# EAGLE design cococartridge (EAGLE 7.5.0)
DESIGNER: Adam Green (https://github.com/adamgreen)
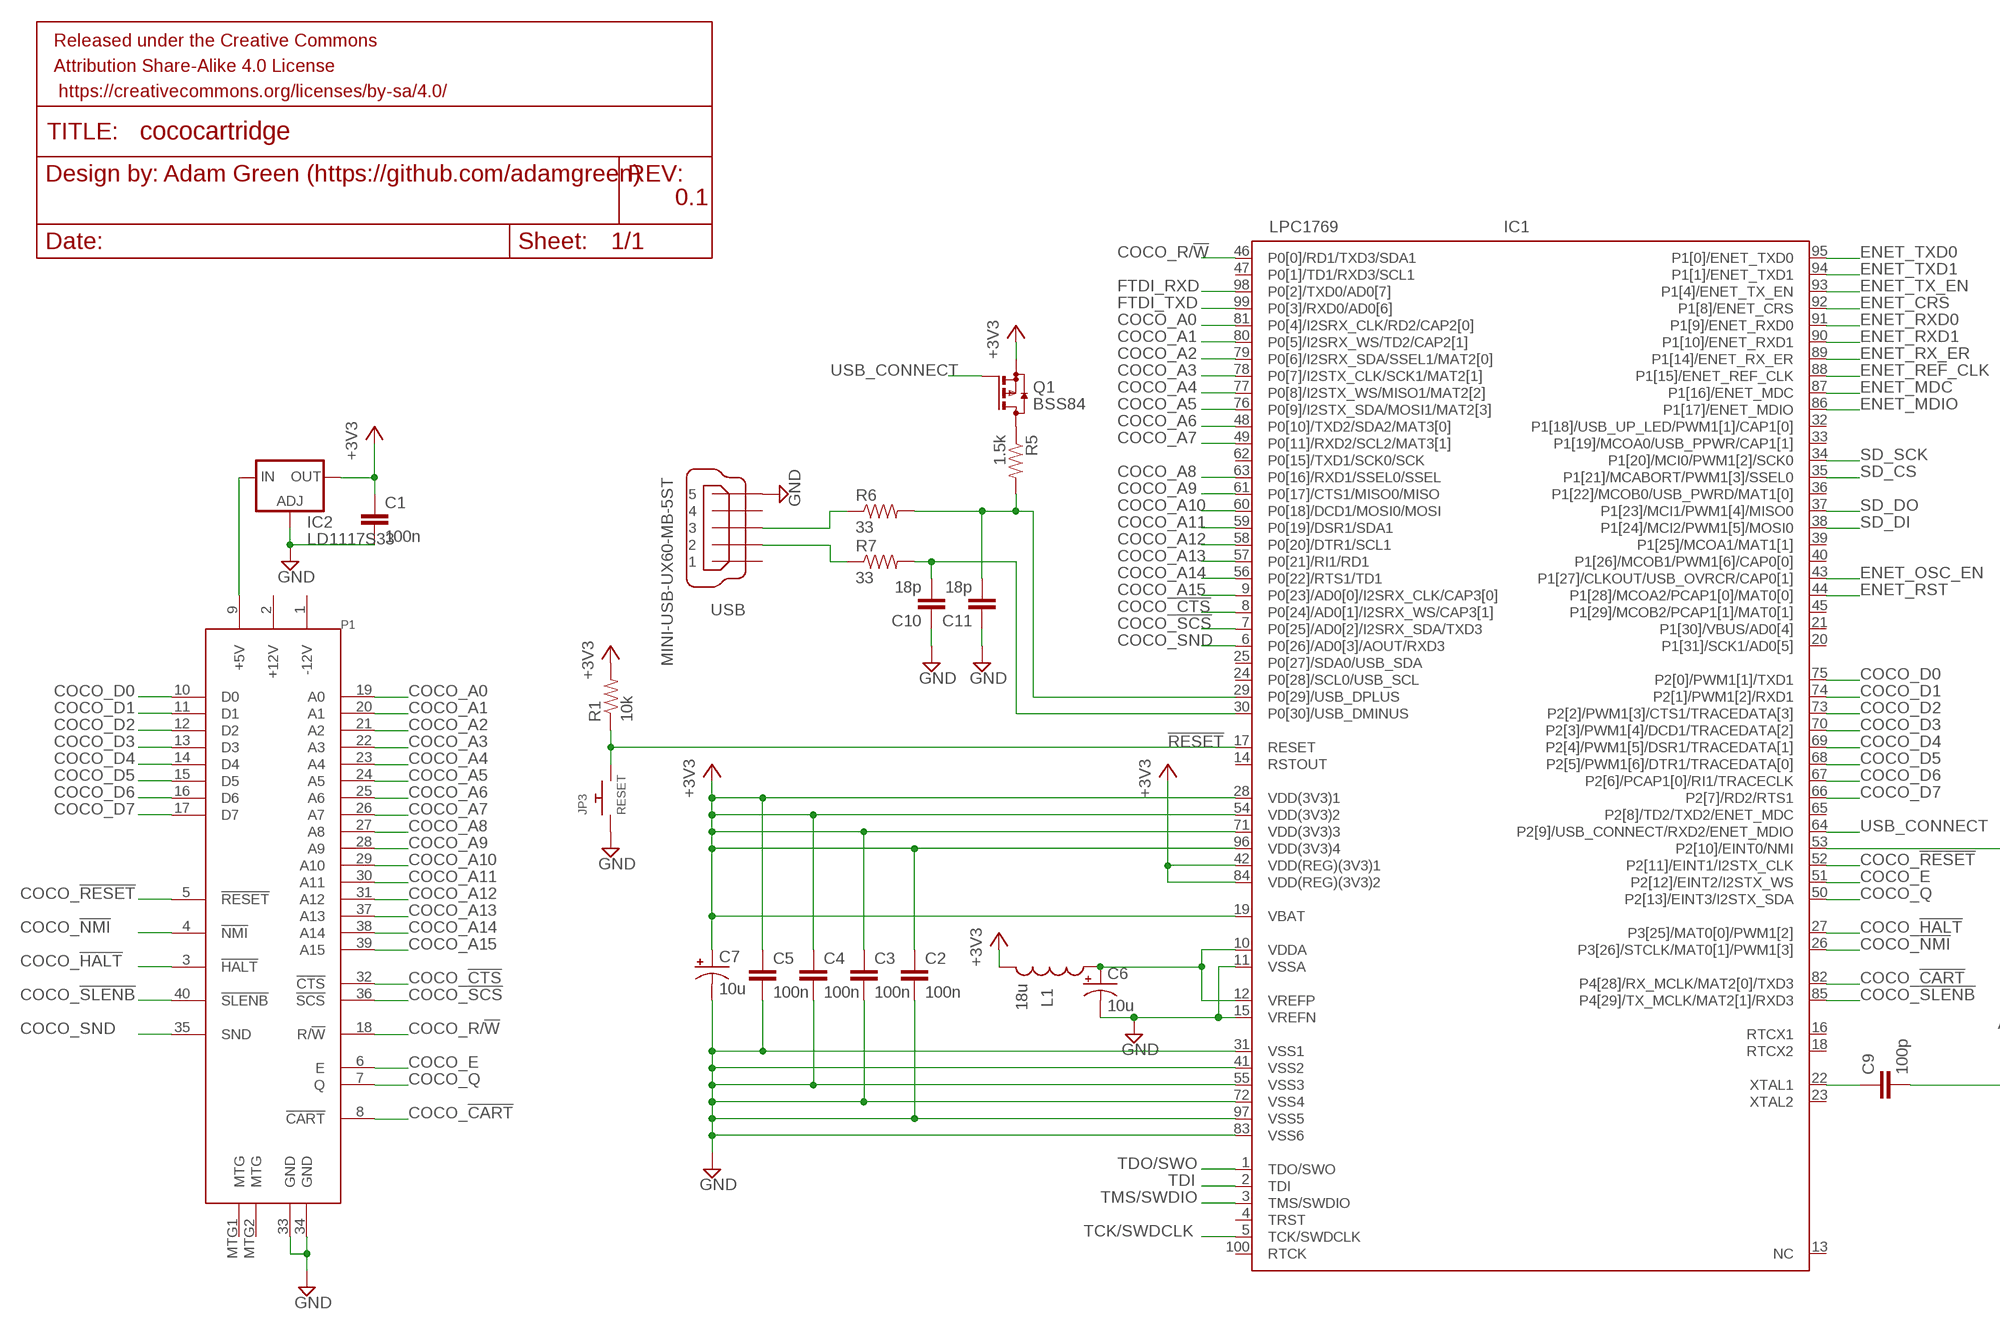
[diagram p0: schematic, sheet 1, part 1 of 2]
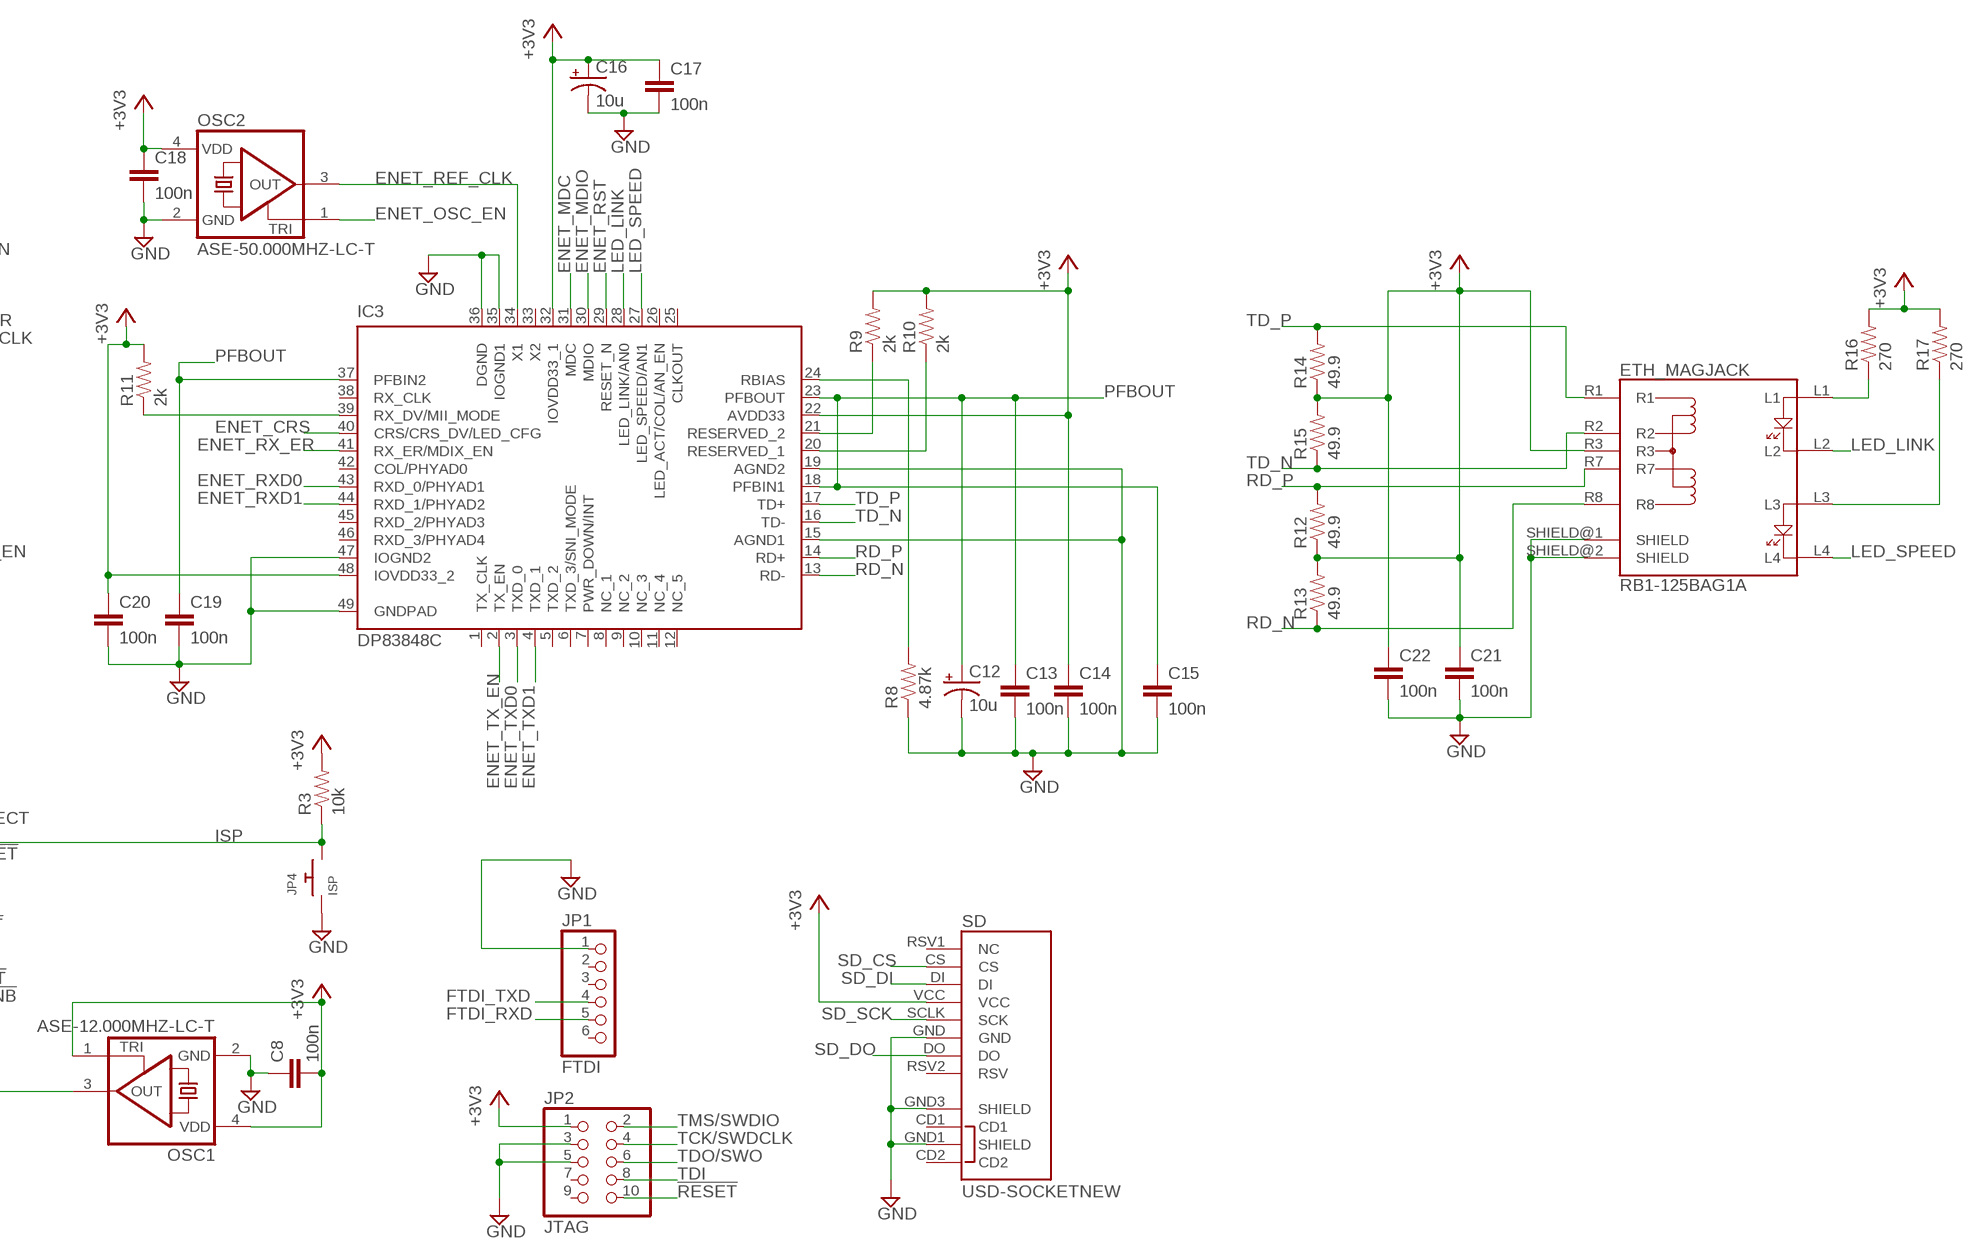
[diagram p1: schematic, sheet 1, part 2 of 2]

## Parts
C1  100n  CAP0805  [0805]
C2  100n  CAP0805  [0805]
C3  100n  CAP0805  [0805]
C4  100n  CAP0805  [0805]
C5  100n  CAP0805  [0805]
C6  10u  CAP_POL1206  [EIA3216]
C7  10u  CAP_POL1206  [EIA3216]
C8  100n  CAP0805  [0805]
C9  100p  CAP0805  [0805]
C10  18p  CAP0805  [0805]
C11  18p  CAP0805  [0805]
C12  10u  CAP_POL1206  [EIA3216]
C13  100n  CAP0805  [0805]
C14  100n  CAP0805  [0805]
C15  100n  CAP0805  [0805]
C16  10u  CAP_POL1206  [EIA3216]
C17  100n  CAP0805  [0805]
C18  100n  CAP0805  [0805]
C19  100n  CAP0805  [0805]
C20  100n  CAP0805  [0805]
C21  100n  CAP0805  [0805]
C22  100n  CAP0805  [0805]
ETH_MAGJACK  RB1-125BAG1A  [RB1-125BAG1A]
IC1  LPC1769  [LQFP100-14X14]
IC2  LD1117S33  LD117AS33TR  [SOT223]
IC3  DP83848C  [LQFP48]
JP1  FTDI  PINHD-1X6  [1X06]
JP2  JTAG  FTSH-105  [FTSH-105]
JP3  RESET  JUMPER-1206  [1206]
JP4  ISP  JUMPER-1206  [1206]
L1  18u  INDUCTOR1210  [1210]
OSC1  ASE-12.000MHZ-LC-T  ASE  [ASE]
OSC2  ASE-50.000MHZ-LC-T  ASE  [ASE]
P1  COCO-CART3.5X2.5  [COCO-CART-3.5X2.5]
Q1  BSS84  [SOT23]
R1  10k  RESISTOR0805-RES  [0805]
R3  10k  RESISTOR0805-RES  [0805]
R5  1.5k  RESISTOR0805-RES  [0805]
R6  33  RESISTOR0805-RES  [0805]
R7  33  RESISTOR0805-RES  [0805]
R8  4.87k  RESISTOR0805-RES  [0805]
R9  2k  RESISTOR0805-RES  [0805]
R10  2k  RESISTOR0805-RES  [0805]
R11  2k  RESISTOR0805-RES  [0805]
R12  49.9  RESISTOR0805-RES  [0805]
R13  49.9  RESISTOR0805-RES  [0805]
R14  49.9  RESISTOR0805-RES  [0805]
R15  49.9  RESISTOR0805-RES  [0805]
R16  270  RESISTOR0805-RES  [0805]
R17  270  RESISTOR0805-RES  [0805]
SD  USD-SOCKETNEW  [MICRO-SD-SOCKET-PP]
USB  MINI-USB-UX60-MB-5ST  [UX60-MB-5ST]

## Nets
!RESET: IC1.17(RESET) JP2.10 JP3.2 R1.1
+3V3 [supply]: C1.1 C2.1 C3.1 C4.1 C5.1 C7.A(+) C8.2 C14.1 C16.A(+) C17.1 C18.1 C20.1 C21.1 C22.1 ETH_MAGJACK.R3 IC1.19(VBAT) IC1.28(VDD(3V3)1) IC1.42(VDD(REG)(3V3)1) IC1.54(VDD(3V3)2) IC1.71(VDD(3V3)3) IC1.84(VDD(REG)(3V3)2) IC1.96(VDD(3V3)4) IC2.4(OUT) IC3.22(AVDD33) IC3.32(IOVDD33_1) IC3.48(IOVDD33_2) JP2.1 L1.2 OSC1.1(TRI) OSC1.4(VDD) OSC2.4(VDD) Q1.2(S) R1.2 R3.2 R9.2 R10.2 R11.2 R12.1 R13.2 R14.1 R15.2 R16.2 R17.2 SD.VCC
+5V [supply]: IC2.3(IN) P1.9(+5V)
COCO_!CART: IC1.82(P4[28]/RX_MCLK/MAT2[0]/TXD3) P1.8(!CART)
COCO_!CTS: IC1.8(P0[24]/AD0[1]/I2SRX_WS/CAP3[1]) P1.32(!CTS)
COCO_!HALT: IC1.27(P3[25]/MAT0[0]/PWM1[2]) P1.3(!HALT)
COCO_!NMI: IC1.26(P3[26]/STCLK/MAT0[1]/PWM1[3]) P1.4(!NMI)
COCO_!RESET: IC1.52(P2[11]/EINT1/I2STX_CLK) P1.5(!RESET)
COCO_!SCS: IC1.7(P0[25]/AD0[2]/I2SRX_SDA/TXD3) P1.36(!SCS)
COCO_!SLENB: IC1.85(P4[29]/TX_MCLK/MAT2[1]/RXD3) P1.40(!SLENB)
COCO_A0: IC1.81(P0[4]/I2SRX_CLK/RD2/CAP2[0]) P1.19(A0)
COCO_A1: IC1.80(P0[5]/I2SRX_WS/TD2/CAP2[1]) P1.20(A1)
COCO_A2: IC1.79(P0[6]/I2SRX_SDA/SSEL1/MAT2[0]) P1.21(A2)
COCO_A3: IC1.78(P0[7]/I2STX_CLK/SCK1/MAT2[1]) P1.22(A3)
COCO_A4: IC1.77(P0[8]/I2STX_WS/MISO1/MAT2[2]) P1.23(A4)
COCO_A5: IC1.76(P0[9]/I2STX_SDA/MOSI1/MAT2[3]) P1.24(A5)
COCO_A6: IC1.48(P0[10]/TXD2/SDA2/MAT3[0]) P1.25(A6)
COCO_A7: IC1.49(P0[11]/RXD2/SCL2/MAT3[1]) P1.26(A7)
COCO_A8: IC1.63(P0[16]/RXD1/SSEL0/SSEL) P1.27(A8)
COCO_A9: IC1.61(P0[17]/CTS1/MISO0/MISO) P1.28(A9)
COCO_A10: IC1.60(P0[18]/DCD1/MOSI0/MOSI) P1.29(A10)
COCO_A11: IC1.59(P0[19]/DSR1/SDA1) P1.30(A11)
COCO_A12: IC1.58(P0[20]/DTR1/SCL1) P1.31(A12)
COCO_A13: IC1.57(P0[21]/RI1/RD1) P1.37(A13)
COCO_A14: IC1.56(P0[22]/RTS1/TD1) P1.38(A14)
COCO_A15: IC1.9(P0[23]/AD0[0]/I2SRX_CLK/CAP3[0]) P1.39(A15)
COCO_D0: IC1.75(P2[0]/PWM1[1]/TXD1) P1.10(D0)
COCO_D1: IC1.74(P2[1]/PWM1[2]/RXD1) P1.11(D1)
COCO_D2: IC1.73(P2[2]/PWM1[3]/CTS1/TRACEDATA[3]) P1.12(D2)
COCO_D3: IC1.70(P2[3]/PWM1[4]/DCD1/TRACEDATA[2]) P1.13(D3)
COCO_D4: IC1.69(P2[4]/PWM1[5]/DSR1/TRACEDATA[1]) P1.14(D4)
COCO_D5: IC1.68(P2[5]/PWM1[6]/DTR1/TRACEDATA[0]) P1.15(D5)
COCO_D6: IC1.67(P2[6]/PCAP1[0]/RI1/TRACECLK) P1.16(D6)
COCO_D7: IC1.66(P2[7]/RD2/RTS1) P1.17(D7)
COCO_E: IC1.51(P2[12]/EINT2/I2STX_WS) P1.6(E)
COCO_Q: IC1.50(P2[13]/EINT3/I2STX_SDA) P1.7(Q)
COCO_R/!W: IC1.46(P0[0]/RD1/TXD3/SDA1) P1.18(R/!W)
COCO_SND: IC1.6(P0[26]/AD0[3]/AOUT/RXD3) P1.35(SND)
ENET_CRS: IC1.92(P1[8]/ENET_CRS) IC3.40(CRS/CRS_DV/LED_CFG)
ENET_MDC: IC1.87(P1[16]/ENET_MDC) IC3.31(MDC)
ENET_MDIO: IC1.86(P1[17]/ENET_MDIO) IC3.30(MDIO)
ENET_OSC_EN: IC1.43(P1[27]/CLKOUT/USB_OVRCR/CAP0[1]) OSC2.1(TRI)
ENET_REF_CLK: IC1.88(P1[15]/ENET_REF_CLK) IC3.34(X1) OSC2.3(OUT)
ENET_RST: IC1.44(P1[28]/MCOA2/PCAP1[0]/MAT0[0]) IC3.29(RESET_N)
ENET_RX_ER: IC1.89(P1[14]/ENET_RX_ER) IC3.41(RX_ER/MDIX_EN)
ENET_RXD0: IC1.91(P1[9]/ENET_RXD0) IC3.43(RXD_0/PHYAD1)
ENET_RXD1: IC1.90(P1[10]/ENET_RXD1) IC3.44(RXD_1/PHYAD2)
ENET_TX_EN: IC1.93(P1[4]/ENET_TX_EN) IC3.2(TX_EN)
ENET_TXD0: IC1.95(P1[0]/ENET_TXD0) IC3.3(TXD_0)
ENET_TXD1: IC1.94(P1[1]/ENET_TXD1) IC3.4(TXD_1)
FTDI_RXD: IC1.98(P0[2]/TXD0/AD0[7]) JP1.5
FTDI_TXD: IC1.99(P0[3]/RXD0/AD0[6]) JP1.4
GND [supply]: C1.2 C2.2 C3.2 C4.2 C5.2 C6.C(-) C7.C(-) C8.1 C10.1 C11.1 C12.C(-) C13.2 C14.2 C15.2 C16.C(-) C17.2 C18.2 C19.2 C20.2 C21.2 C22.2 ETH_MAGJACK.SHIELD@1(SHIELD) ETH_MAGJACK.SHIELD@2(SHIELD) IC1.11(VSSA) IC1.15(VREFN) IC1.31(VSS1) IC1.41(VSS2) IC1.55(VSS3) IC1.72(VSS4) IC1.83(VSS6) IC1.97(VSS5) IC2.1(ADJ) IC3.15(AGND1) IC3.19(AGND2) IC3.35(IOGND1) IC3.36(DGND) IC3.47(IOGND2) IC3.49(GNDPAD) JP1.1 JP2.3 JP2.5 JP3.1 JP4.1 OSC1.2(GND) OSC2.2(GND) P1.33(GND) P1.34(GND) R8.1 SD.GND SD.GND1(SHIELD) SD.GND3(SHIELD) USB.5
ISP: IC1.53(P2[10]/EINT0/NMI) JP4.2 R3.1
LED_LINK: ETH_MAGJACK.L2 IC3.28(LED_LINK/AN0)
LED_SPEED: ETH_MAGJACK.L4 IC3.27(LED_SPEED/AN1)
N$3: C6.A(+) IC1.10(VDDA) IC1.12(VREFP) L1.1
N$4: C9.1 IC1.22(XTAL1)
N$5: C9.2 OSC1.3(OUT)
N$6: IC3.24(RBIAS) R8.2
N$8: Q1.3(D) R5.1
N$11: IC3.39(RX_DV/MII_MODE) R11.1
N$12: IC3.21(RESERVED_2) R9.1
N$13: IC3.20(RESERVED_1) R10.1
N$14: ETH_MAGJACK.L1 R16.1
N$15: ETH_MAGJACK.L3 R17.1
PFBOUT: C12.A(+) C13.1 C15.1 C19.1 IC3.18(PFBIN1) IC3.23(PFBOUT) IC3.37(PFBIN2)
RD_N [ethernet]: ETH_MAGJACK.R8 IC3.13(RD-) R13.1
RD_P [ethernet]: ETH_MAGJACK.R7 IC3.14(RD+) R12.2
SD_CS: IC1.35(P1[21]/MCABORT/PWM1[3]/SSEL0) SD.CS
SD_DI: IC1.38(P1[24]/MCI2/PWM1[5]/MOSI0) SD.DI
SD_DO: IC1.37(P1[23]/MCI1/PWM1[4]/MISO0) SD.DO
SD_SCK: IC1.34(P1[20]/MCI0/PWM1[2]/SCK0) SD.SCLK(SCK)
TCK/SWDCLK: IC1.5(TCK/SWDCLK) JP2.4
TD_N [ethernet]: ETH_MAGJACK.R2 IC3.16(TD-) R15.1
TD_P [ethernet]: ETH_MAGJACK.R1 IC3.17(TD+) R14.2
TDI: IC1.2(TDI) JP2.8
TDO/SWO: IC1.1(TDO/SWO) JP2.6
TMS/SWDIO: IC1.3(TMS/SWDIO) JP2.2
USB2_N [usb]: R7.1 USB.2
USB2_P [usb]: R6.1 USB.3
USB_CONNECT: IC1.64(P2[9]/USB_CONNECT/RXD2/ENET_MDIO) Q1.1(G)
USB_N [usb]: C10.2 IC1.30(P0[30]/USB_DMINUS) R7.2
USB_P [usb]: C11.2 IC1.29(P0[29]/USB_DPLUS) R5.2 R6.2
Unconnected: IC1.4(TRST) IC1.13(NC) IC1.14(RSTOUT) IC1.16(RTCX1) IC1.18(RTCX2) IC1.20(P1[31]/SCK1/AD0[5]) IC1.21(P1[30]/VBUS/AD0[4]) IC1.23(XTAL2) IC1.24(P0[28]/SCL0/USB_SCL) IC1.25(P0[27]/SDA0/USB_SDA) IC1.32(P1[18]/USB_UP_LED/PWM1[1]/CAP1[0]) IC1.33(P1[19]/MCOA0/USB_PPWR/CAP1[1]) IC1.36(P1[22]/MCOB0/USB_PWRD/MAT1[0]) IC1.39(P1[25]/MCOA1/MAT1[1]) IC1.40(P1[26]/MCOB1/PWM1[6]/CAP0[0]) IC1.45(P1[29]/MCOB2/PCAP1[1]/MAT0[1]) IC1.47(P0[1]/TD1/RXD3/SCL1) IC1.62(P0[15]/TXD1/SCK0/SCK) IC1.65(P2[8]/TD2/TXD2/ENET_MDC) IC1.100(RTCK) IC3.1(TX_CLK) IC3.5(TXD_2) IC3.6(TXD_3/SNI_MODE) IC3.7(PWR_DOWN/INT) IC3.8(NC_1) IC3.9(NC_2) IC3.10(NC_3) IC3.11(NC_4) IC3.12(NC_5) IC3.25(CLKOUT) IC3.26(LED_ACT/COL/AN_EN) IC3.33(X2) IC3.38(RX_CLK) IC3.42(COL/PHYAD0) IC3.45(RXD_2/PHYAD3) IC3.46(RXD_3/PHYAD4) JP1.2 JP1.3 JP1.6 JP2.7 JP2.9 P1.1(-12V) P1.2(+12V) P1.MTG1(MTG) P1.MTG2(MTG) SD.CD1 SD.CD2 SD.RSV1(NC) SD.RSV2(RSV) USB.1 USB.4

## Notes on the sheet
- 0.1

## Library data of the parts
C1-C5 C8-C11 C13-C15 C17-C22 = SparkFun-Passives:CAP: Capacitor Standard 0603 ceramic capacitor, and 0.1" leaded capacitor.
C6 C7 C12 C16 = SparkFun-Capacitors:CAP_POL: Capacitor Polarized These are standard SMD and PTH capacitors. Normally 10uF, 47uF, and 100uF in electrolytic and tantalum varieties. Always verify the external diameter of the through hole cap, it varies with capacity, voltage, and manufacturer. The EIA devices should be standard.
ETH_MAGJACK = adam_custom:RB1-125BAG1A: MagJack RB1-125BAG1A Based on libraries found in this Eagle project: https://github.com/4jochen/WIZ820io-Piggyback-RaspberryPi
IC1 = lpc1xxx-v6:LPC1769: LPC1769 120 MHz 32-bit ARM Cortex-M3 based microcontroller featuring a high level of integration and low power consumption. 512 kB Flash, 64 kB SRAM, USB Device/Host/OTG, 2 CAN, DAC, Ethernet MarcVl - Datasheet available on www.nxp.com
IC2 = v-reg:LD117A?*: Low drop fixed and adjustable positive voltage regulators 1 A Source: http://www.st.com/stonline/products/literature/ds/7194/ld1117axx.pdf
IC3 = adam_custom:DP83848C: PHYTER® - Extended Temperature Single Port 10/100 Mb/s Ethernet Physical Layer Transceiver Based on device described in National Semiconductor library that ships with Eagle. Auto generated by make-symbol-device-package-bsdl.ulp Rev. 34 Source: dp83848yb.bsdl http://www.national.com/ds/DP/DP83848VYB.pdf
JP1 = pinhead:PINHD-1X6: PIN HEADER
JP2 = adam_custom:FTSH-105: Semtec FSH-105 2x5 SMT Micro Header Commonly used for 10-pin ARM Cortex-M JTAG/SWD Debug Header.
JP3 JP4 = adam_custom:JUMPER-1206: Jumper based on 1206 SMT pads Useful for switches that won't often be used. Can short out temporarily with tweezers or solder a switch to during development. Symbol is based on one from Adafruit Eagle library found here: https://github.com/adafruit/Adafruit-Eagle-Library
L1 = SparkFun-Passives:INDUCTOR: Inductors Basic Inductor/Choke - 0603 and 1206. Footprints are not proven and vary greatly between part numbers. INDUCTOR POWER 3.3UH 4.0A SMD 0.197" L x 0.197" W x 0.177" H (5.00mm x 5.00mm x 4.50mm)
OSC1 OSC2 = crystal:ASE: 3.3Vdc CMOS SMD CRYSTAL CLOCK OSCILLATOR SOurce: www.abracon.com; OC_FARNELL: unknown; OC_NEWARK: unknown
P1 = adam_custom:COCO-CART: Tandy/TRS-80 Color Computer Cartridge Connector Based on Mark J. Blair's CoCo cartridge Eagle project found here: https://github.com/NF6X/CoCoEPROMpak
Q1 = transistor-small-signal:BSS84: P-CHANNEL MOS FET
R1 R3 R5-R17 = SparkFun-Resistors:RESISTOR: Resistor Basic schematic elements and footprints for 0603, 1206, and PTH resistors.
SD = adam_custom:USD-SOCKET: microSD Socket Push-push type uSD socket. Schematic element and footprint production proven. Spark Fun Electronics SKU : PRT-00127. tDoc lines correctly indicate media card edge positions when inserting (unlocked, locked, depressed). NOTE: CD1 and CD2 are connected internally; PROD_ID: CONN-07820
USB = con-hirose:MINI-USB-: MINI USB Connector Source: http://www.hirose.co.jp/cataloge_hp/e24000019.pdf; OC_FARNELL: unknown; OC_NEWARK: unknown

## Net classes
0 default: width 0.152 mm, clearance 0.152 mm
1 supply: width 0.152 mm, clearance 0.152 mm
2 io: width 0.152 mm, clearance 0.152 mm
3 usb: width 0.254 mm, clearance 0.152 mm
4 ethernet: width 0.254 mm, clearance 0.152 mm

## Board
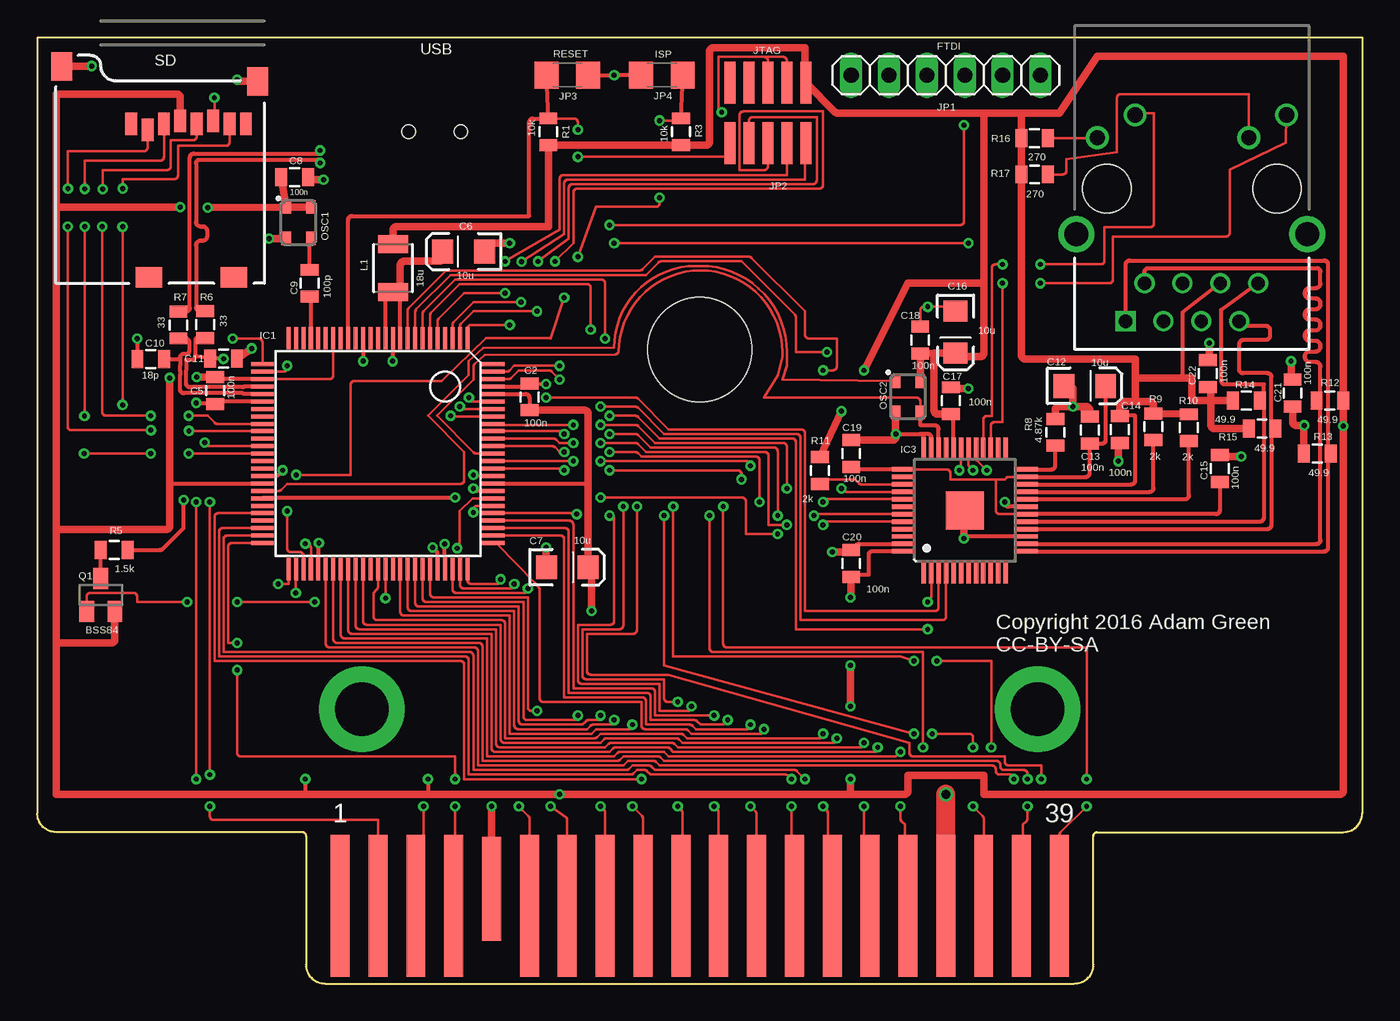
[diagram p2: board, top side]
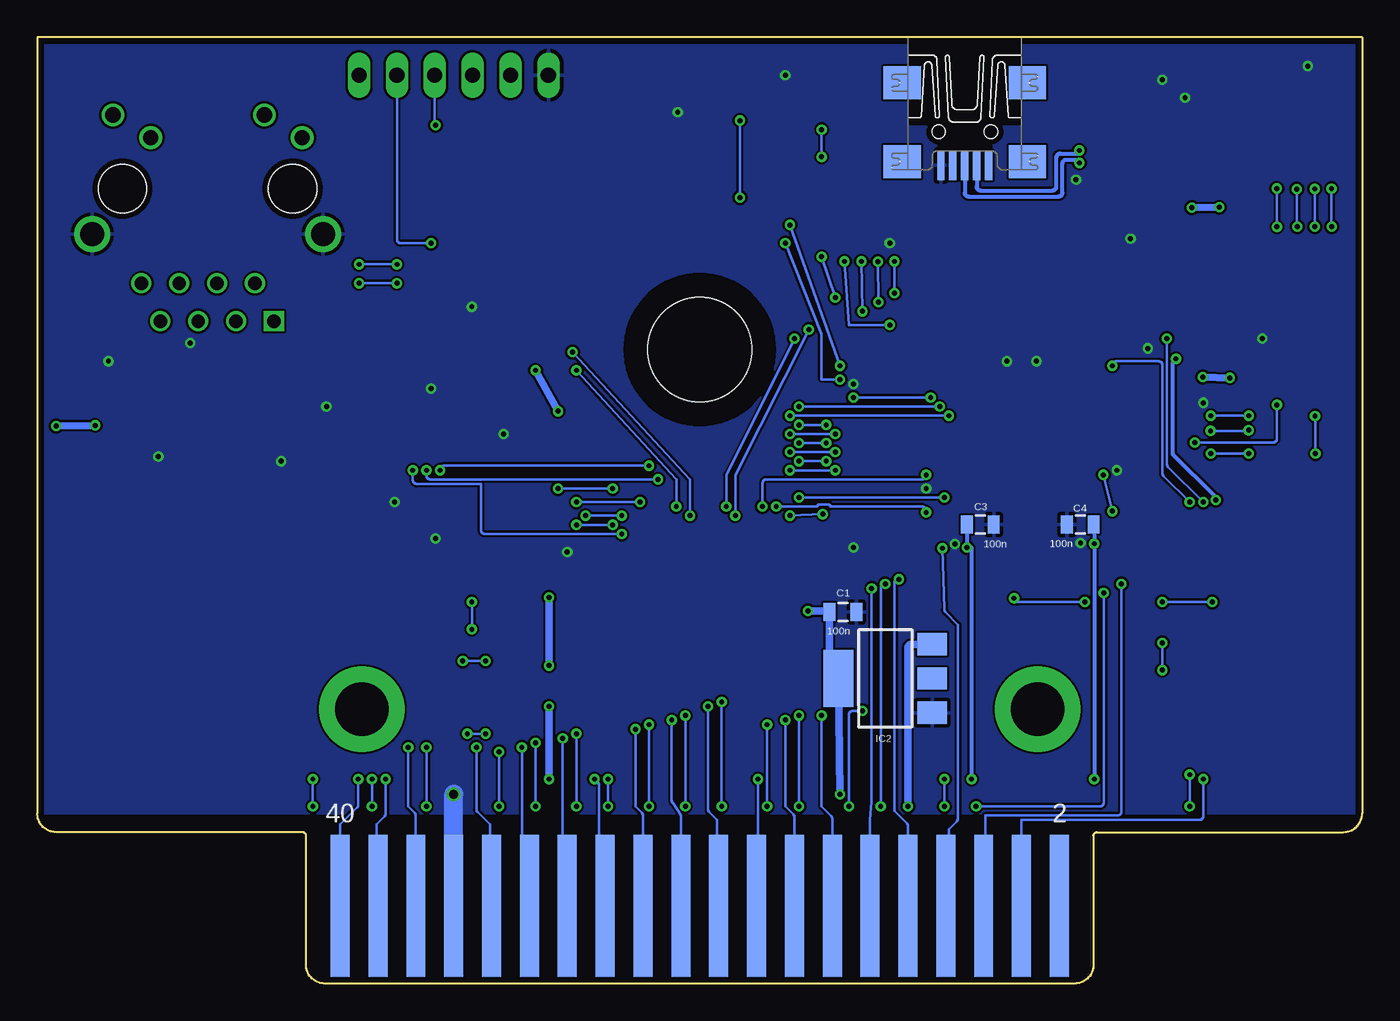
[diagram p3: board, bottom side, seen from below]

Size 88.9 x 63.5 mm. Coordinates in mm from the lower left corner, seen from the top.
Copper layers (1*16): Top 0.0356mm / dielectric 1.5011mm / Bottom 0.0356mm
Design rules "LaenPCBOrder": minimum track width 6mil, minimum drill 13mil, track to track 6mil, track to pad 6mil, pad to pad 6mil, via to via 6mil, smd to smd 6mil, copper to edge 15mil, drill to drill 6mil, minimum pad ring 7mil, minimum via ring 7mil, stop-mask expansion 3mil, vias tented up to drill 0mil, thermal gap 10mil

### Footprints (pad centres in the part's own frame; a part is rotated, then mirrored left to right if it is on the bottom)
0805 = smd 0.8 x 1.2: 1 -0.9,0; 2 0.9,0
EIA3216 = smd 1.4 x 1.6: A 1.4,0; C -1.4,0
RB1-125BAG1A = drill 1.02: L1 6.35,-3.429; L2 3.81,-4.953; L3 -3.81,-3.429; L4 -6.35,-4.953 | drill 0.9: R1 -4.445,6.35; R2 -3.175,8.89; R3 -1.905,6.35; R4 -0.635,8.89; R5 0.635,6.35; R6 1.905,8.89; R7 3.175,6.35 | drill 0.9 square: R8 4.445,8.89 | drill 1.6: SHIELD@1 -7.747,3.048; SHIELD@2 7.747,3.048 | hole 3.25: 5.715,0; -5.715,0
LQFP100-14X14 = smd 0.27 x 1.5: 1 -6,-7.75; 2 -5.5,-7.75; 3 -5,-7.75; 4 -4.5,-7.75; 5 -4,-7.75; 6 -3.5,-7.75; 7 -3,-7.75; 8 -2.5,-7.75; 9 -2,-7.75; 10 -1.5,-7.75; 11 -1,-7.75; 12 -0.5,-7.75; 13 0,-7.75; 14 0.5,-7.75; 15 1,-7.75; 16 1.5,-7.75; 17 2,-7.75; 18 2.5,-7.75; 19 3,-7.75; 20 3.5,-7.75; 21 4,-7.75; 22 4.5,-7.75; 23 5,-7.75; 24 5.5,-7.75; 25 6,-7.75; 51 6,7.75; 52 5.5,7.75; 53 5,7.75; 54 4.5,7.75; 55 4,7.75; 56 3.5,7.75; 57 3,7.75; 58 2.5,7.75; 59 2,7.75; 60 1.5,7.75; 61 1,7.75; 62 0.5,7.75; 63 0,7.75; 64 -0.5,7.75; 65 -1,7.75; 66 -1.5,7.75; 67 -2,7.75; 68 -2.5,7.75; 69 -3,7.75; 70 -3.5,7.75; 71 -4,7.75; 72 -4.5,7.75; 73 -5,7.75; 74 -5.5,7.75; 75 -6,7.75 | smd 1.5 x 0.27: 26 7.75,-6; 27 7.75,-5.5; 28 7.75,-5; 29 7.75,-4.5; 30 7.75,-4; 31 7.75,-3.5; 32 7.75,-3; 33 7.75,-2.5; 34 7.75,-2; 35 7.75,-1.5; 36 7.75,-1; 37 7.75,-0.5; 38 7.75,0; 39 7.75,0.5; 40 7.75,1; 41 7.75,1.5; 42 7.75,2; 43 7.75,2.5; 44 7.75,3; 45 7.75,3.5; 46 7.75,4; 47 7.75,4.5; 48 7.75,5; 49 7.75,5.5; 50 7.75,6; 76 -7.75,6; 77 -7.75,5.5; 78 -7.75,5; 79 -7.75,4.5; 80 -7.75,4; 81 -7.75,3.5; 82 -7.75,3; 83 -7.75,2.5; 84 -7.75,2; 85 -7.75,1.5; 86 -7.75,1; 87 -7.75,0.5; 88 -7.75,0; 89 -7.75,-0.5; 90 -7.75,-1; 91 -7.75,-1.5; 92 -7.75,-2; 93 -7.75,-2.5; 94 -7.75,-3; 95 -7.75,-3.5; 96 -7.75,-4; 97 -7.75,-4.5; 98 -7.75,-5; 99 -7.75,-5.5; 100 -7.75,-6
SOT223 = smd 1.5 x 2: 1 -2.3,-3.15; 2 0,-3.15; 3 2.3,-3.15 | smd 3.8 x 2: 4 0,3.15
LQFP48 = smd 1.5 x 0.3: 1 -4.15,2.75; 2 -4.15,2.25; 3 -4.15,1.75; 4 -4.15,1.25; 5 -4.15,0.75; 6 -4.15,0.25; 7 -4.15,-0.25; 8 -4.15,-0.75; 9 -4.15,-1.25; 10 -4.15,-1.75; 11 -4.15,-2.25; 12 -4.15,-2.75; 25 4.15,-2.75; 26 4.15,-2.25; 27 4.15,-1.75; 28 4.15,-1.25; 29 4.15,-0.75; 30 4.15,-0.25; 31 4.15,0.25; 32 4.15,0.75; 33 4.15,1.25; 34 4.15,1.75; 35 4.15,2.25; 36 4.15,2.75 | smd 0.3 x 1.5: 13 -2.75,-4.15; 14 -2.25,-4.15; 15 -1.75,-4.15; 16 -1.25,-4.15; 17 -0.75,-4.15; 18 -0.25,-4.15; 19 0.25,-4.15; 20 0.75,-4.15; 21 1.25,-4.15; 22 1.75,-4.15; 23 2.25,-4.15; 24 2.75,-4.15; 37 2.75,4.15; 38 2.25,4.15; 39 1.75,4.15; 40 1.25,4.15; 41 0.75,4.15; 42 0.25,4.15; 43 -0.25,4.15; 44 -0.75,4.15; 45 -1.25,4.15; 46 -1.75,4.15; 47 -2.25,4.15; 48 -2.75,4.15 | smd 2.54 x 2.54: 49 0,0
1X06 = drill 1.016 long: 1 -6.35,0; 2 -3.81,0; 3 -1.27,0; 4 1.27,0; 5 3.81,0; 6 6.35,0
FTSH-105 = smd 0.737 x 2.794: 1 -2.54,-2.032; 2 -2.54,2.032; 3 -1.27,-2.032; 4 -1.27,2.032; 5 0,-2.032; 6 0,2.032; 7 1.27,-2.032; 8 1.27,2.032; 9 2.54,-2.032; 10 2.54,2.032
1206 = smd 1.6 x 1.8: 1 -1.4,0; 2 1.4,0
1210 = smd 1.2 x 2: 1 -1.6,0; 2 1.6,0
ASE = smd 0.9 x 0.65: 1 -1.05,-0.825; 2 1.05,-0.825; 3 1.05,0.825; 4 -1.05,0.825
COCO-CART-3.5X2.5 = smd 1.27 x 9.525: 1 20.32,5.207; 3 22.86,5.207; 5 25.4,5.207; 7 27.94,5.207; 11 33.02,5.207; 13 35.56,5.207; 15 38.1,5.207; 17 40.64,5.207; 19 43.18,5.207; 21 45.72,5.207; 23 48.26,5.207; 25 50.8,5.207; 27 53.34,5.207; 29 55.88,5.207; 31 58.42,5.207; 33 60.96,5.207; 35 63.5,5.207; 37 66.04,5.207; 39 68.58,5.207 | smd 1.27 x 9.525 bottom: 2 20.32,5.207; 4 22.86,5.207; 6 25.4,5.207; 8 27.94,5.207; 10 30.48,5.207; 12 33.02,5.207; 14 35.56,5.207; 16 38.1,5.207; 18 40.64,5.207; 20 43.18,5.207; 22 45.72,5.207; 24 48.26,5.207; 26 50.8,5.207; 28 53.34,5.207; 30 55.88,5.207; 32 58.42,5.207; 34 60.96,5.207; 36 63.5,5.207; 38 66.04,5.207; 40 68.58,5.207 | smd 1.27 x 6.985: 9 30.48,6.35 | drill 3.607 pad 5.715: MTG1 21.78,18.415; MTG2 67.12,18.415 | hole 6.985: 44.45,42.545
SOT23 = smd 1 x 1.4: 1 -0.95,-1.1; 2 0.95,-1.1; 3 0,1.1
MICRO-SD-SOCKET-PP = smd 1.8 x 1.4: CD1 -2.05,0.4; CD2 -7.75,0.4 | smd 0.8 x 1.5: CS -7.84,10.3; DI -6.74,10.7; DO -2.34,10.7; GND -3.44,10.9; RSV1 -8.94,10.7; RSV2 -1.24,10.7; SCLK -4.54,10.7; VCC -5.64,10.9 | smd 1.4 x 1.9: GND1 -13.6,14.55; GND3 -0.45,13.55
UX60-MB-5ST = smd 2 x 0.5: 1 2.25,1.6; 2 2.25,0.8; 3 2.25,0; 4 2.25,-0.8; 5 2.25,-1.6 | smd 2.2 x 2.5: M1 -3.3,-4.2; M2 -3.3,4.2; M3 2,4.2; M4 2,-4.2 | hole 0.9: 0,-1.75; 0,1.75

### Placement (x,y rotation side)
C1  34.85,24.94 0 bottom
C2  33.02,39.37 90 top
C3  25.63,30.81 0 bottom
C4  18.92,30.81 180 bottom
C5  11.94,39.79 270 top
C6  28.6,49.12 180 top
C7  35.56,27.94 0 top
C8  17.27,54.1 180 top
C9  18.29,46.99 90 top
C10  7.62,41.91 0 top
C11  12.5,41.94 180 top
C12  70.28,40.1 0 top
C13  70.62,37.13 90 top
C14  72.64,37.18 270 top
C15  79.34,34.56 90 top
C16  61.61,43.71 270 top
C17  61.3,39.11 90 top
C18  59.24,43.18 90 top
C19  54.61,35.56 90 top
C20  54.61,28.19 90 top
C21  84.22,39.62 90 top
C22  78.55,40.93 90 top
ETH_MAGJACK  77.47,53.34 180 top
IC1  22.86,35.56 180 top
IC2  32,20.47 90 bottom
IC3  62.23,31.75 90 top
JP1  60.96,60.96 0 top
JP2  49.02,58.42 180 top
JP3  35.56,60.96 180 top
JP4  41.91,60.96 0 top
L1  23.88,48.01 90 top
OSC1  17.53,51.05 270 top
OSC2  58.42,39.37 270 top
P1  0,0 0 top
Q1  4.26,26.08 0 top
R1  34.29,57.15 270 top
R3  43.18,57.15 270 top
R5  5.17,29.1 0 top
R6  11.28,44.22 270 top
R7  9.47,44.2 270 top
R8  68.3,36.99 270 top
R9  74.89,37.36 90 top
R10  77.27,37.3 90 top
R11  52.51,34.43 90 top
R12  86.73,39.11 180 top
R13  85.89,35.57 180 top
R14  81.13,39.13 0 top
R15  82.18,37.25 180 top
R16  66.92,56.73 180 top
R17  66.92,54.3 180 top
SD  15.24,46.99 0 top
USB  26.67,57.15 270 bottom

### Tracks (layer width: path | path; a pad name or v marks a point on that pad's centre or on a via)
!RESET  (via drill 0.33)
  Top 0.152: v36.27,55.47 46.23,55.47 arc90 46.48,55.73 JP2.10 | v36.27,57.3 36.27,57.8 arc90 36.02,58.05 R1.1
  Top 0.254: JP3.2 R1.1 33.26,58.05 arc90 33.01,57.8 33.01,51.5 21.11,51.5 arc90 20.86,51.25 IC1.17
  Bottom 0.152: v36.27,57.3 v36.27,55.47
+3V3  (via drill 0.33)
  Top 0.152: IC1.28 19.61,40.56 arc90 19.86,40.81 IC1.19 | IC1.54 18.36,29.26 arc90 18.11,29.52 v17.98,29.52
  Top 0.254: 36.96,33.4 arc90 36.83,33.53 36.83,33.56 IC1.84 | IC1.96 32.77,39.56 arc-90 33.02,39.31 C2.1 | IC1.28 12.16,40.56 arc-90 C5.1 | IC3.32 61.48,38.03 arc90 C17.1 | IC3.22 73.41,33.5 arc90 73.66,33.75 73.66,38.1 72.66,38.1 arc90 C14.1 | 8.89,33.31 8.89,33.02 | ETH_MAGJACK.R3 76.83,45.03 76.83,40.89 arc-90 76.58,40.64 76.2,40.64 | IC1.71 26.86,28.81 arc45 26.79,28.99 v26.52,29.26 | IC3.48 56.03,29 arc90 55.78,28.75 55.78,27.43 54.75,27.43 arc90 C20.1 | IC1.42 arc-90 15.08,33.53 8.89,33.53 | v26.21,13.72 26.21,12.7 | v17.98,13.72 17.98,12.7
  Top 0.508: SD.VCC 9.6,59.44 arc90 9.35,59.69 1.27,59.69 1.27,52.07 | 1.27,52.07 1.27,30.48 | 1.27,30.48 1.27,22.86 | 1.27,22.86 1.27,12.7 17.98,12.7 26.21,12.7 v35.05,12.7 54.56,12.7 | 1.3,52.1 arc90 1.27,52.07 | C2.1 36.71,38.47 arc-90 36.96,38.22 36.96,33.4 C7.A arc90 36.83,27.81 36.93,27.81 arc-90 37.19,27.56 v37.19,24.99 | 87.63,38.1 v87.63,37.41 87.63,12.95 arc-90 87.38,12.7 63.5,12.7 63.5,13.97 58.42,13.97 58.42,12.95 arc-90 58.17,12.7 54.56,12.7 | 87.63,38.1 87.63,62.23 71.12,62.23 68.58,58.42 arc-90 68.57,58.41 66.04,58.41 | 62.23,42.06 arc90 61.98,42.31 C16.A 60.18,42.29 | 62.23,42.06 62.23,41.91 | 60.18,42.29 C18.1 OSC2.4 | C17.1 60.43,38.21 arc-90 60.18,38.47 60.18,42.29 | C8.2 OSC1.1 OSC1.4 v11.43,52.07 | L1.2 23.88,50.55 arc-90 24.13,50.8 34.29,50.8 R1.2 R3.2 44.86,56.25 arc90 45.11,56.5 45.11,62.53 arc-90 45.37,62.79 51.51,62.79 51.51,60.5 arc90 JP2.1 53.53,58.49 arc45 53.71,58.41 63.5,58.41 | 63.5,58.41 66.04,58.41 | R10.2 R9.2 74.89,38.8 arc90 74.64,39.05 73.66,39.05 | 73.66,39.05 72.9,39.05 arc90 72.64,38.8 C14.1 | 73.66,40.64 73.66,41.91 66.29,41.91 arc-90 66.04,42.16 66.04,54.61 | 73.66,40.64 73.66,39.05 | R14.1 78.74,39.13 | 78.74,39.13 77.72,39.13 arc-90 77.47,39.38 77.47,40.64 76.2,40.64 73.66,40.64 | R15.2 78.99,37.25 arc-90 78.74,37.5 78.74,39.13 | R13.2 84.99,37.43 arc-90 v85.01,37.46 84.48,37.46 arc-90 84.22,37.71 C21.1 | C22.1 arc-90 78.74,39.84 78.74,39.13 | 66.04,54.61 66.04,57.15 | 66.04,57.15 66.04,58.41 | 62.23,42.06 63.25,42.06 arc90 63.5,42.31 63.5,46.99 | 63.5,46.99 63.5,58.41 | 63.5,46.99 58.42,46.99 v55.47,41.15 | R16.2 66.04,57.15 | R17.2 66.04,54.61
  Top 0.508: v8.89,40.64 8.89,33.53 8.89,33.02 8.89,30.73 arc-90 8.64,30.48 1.27,30.48 | C5.1 v10.7,40.7 | v9.59,52.09 1.29,52.09 arc90 1.27,52.07 | R12.1 87.63,38.1 arc-90 87.63,38.1 | Q1.2 5.21,23.11 arc-90 4.96,22.86 1.27,22.86 | v53.95,38.41 R11.2 | v54.56,13.72 54.56,12.7 | C20.1 54.61,25.96 arc-90 v54.56,25.91 | v54.56,21.34 v54.56,18.59
  Bottom 0.254: v26.21,13.72 26.21,29.26 v26.52,29.26 C3.1 | v17.98,13.72 v17.98,29.52 C4.1
  Bottom 0.508: v85.01,37.46 v87.63,37.41 | v10.7,40.7 v8.89,40.64 | v11.43,52.07 v9.59,52.09 | v55.47,41.15 v53.95,38.41 | v37.19,24.99 35.8,24.99 arc90 C1.1 35.75,21.17 arc-45 35.67,20.99 IC2.4 v35.05,12.7 | v54.56,25.91 v54.56,21.34 | v54.56,18.59 v54.56,13.72
+5V  (via drill 0.33)
  Top 0.508: P1.9 v30.48,11.89
  Bottom 0.508: v30.48,11.89 30.48,22.52 arc90 30.23,22.77 IC2.3
COCO_!CART  (via drill 0.33)
  Top 0.152: IC1.82 29.21,32.56 28.35,31.7 28.35,29.39 v28.17,29.21
  Bottom 0.152: P1.8 27.81,5.34 arc-45 27.74,5.51 27.74,10.36 27.2,10.9 arc-45 27.13,11.08 27.13,24.08 27.97,24.92 arc45 28.04,25.1 v28.17,29.21
COCO_!CTS  (via drill 0.33)
  Top 0.152: IC1.8 25.36,45.07 arc-45 25.43,45.25 27.74,47.55 40.84,47.55 41.68,48.39 arc-45 41.86,48.46 47.24,48.46 50.83,44.88 arc-45 50.9,44.7 50.9,42.37 v52.98,42.37 | v45.11,31.39 45.11,22.5 arc90 45.36,22.25 59.44,22.25 v59.44,15.85
  Bottom 0.152: v52.98,42.37 45.11,33.83 v45.11,31.39 | v59.44,15.85 59.44,11.69 arc-45 59.36,11.51 58.52,10.67 58.52,5.41 arc-45 58.45,5.23 P1.32
COCO_!HALT  (via drill 0.33)
  Top 0.152: IC1.27 16.51,41.06 arc90 16.76,41.31 v16.76,41.45 | v11.58,32.31 v11.58,14.02 | P1.3 22.86,10.97 11.84,10.97 arc-90 11.58,11.23 v11.58,11.89
  Bottom 0.152: v16.76,41.45 16.76,41.5 arc90 16.51,41.76 13.66,41.76 arc90 13.41,41.5 13.41,34.24 arc-45 13.34,34.06 v11.58,32.31 | v11.58,14.02 v11.58,11.89
COCO_!NMI  (via drill 0.33)
  Top 0.152: v13.11,43.28 14.86,43.28 arc-90 15.11,43.03 IC1.26 | v10.67,32.31 v10.67,13.72
  Bottom 0.152: v13.11,43.28 13.11,34.85 arc-45 13.03,34.67 v10.67,32.31 | v10.67,13.72 10.67,11.23 arc90 10.92,10.97 22.86,10.97 P1.4
COCO_!RESET  (via drill 0.33)
  Top 0.152: v25.91,11.89 25.91,5.46 arc-90 25.65,5.21 P1.5 | IC1.52 arc-90 17.37,27.8 v17.35,26.21
  Bottom 0.152: v17.35,26.21 17.35,12.14 arc90 17.6,11.89 v25.91,11.89
COCO_!SCS  (via drill 0.33)
  Top 0.152: IC1.7 25.86,44.96 arc-45 25.93,45.14 28.04,47.24 37.85,47.24 arc-90 38.1,46.99 v38.1,43.28 | v42.67,32 42.67,21.95 57.91,21.95 v58.83,21.64 | v60.35,21.64 64.01,21.64 v64.01,15.85
  Bottom 0.152: v38.1,43.28 42.67,34.14 v42.67,32 | P1.36 63.5,11.27 arc-45 63.57,11.45 64.01,11.89 v64.01,15.85 | v58.83,21.64 v60.35,21.64
COCO_!SLENB  (via drill 0.33)
  Top 0.152: IC1.85 29.34,34.06 arc-90 v29.26,34.14 | v40.23,32 40.23,23.72 arc-90 39.98,23.47 36.88,23.47 36.88,20.98 arc90 37.13,20.73 42.37,20.73 58.52,16.15 58.52,15.49 arc90 58.78,15.24 64.92,15.24 64.92,14.88 arc90 65.18,14.63 67.36,14.63 v67.36,13.72
  Bottom 0.152: v29.26,34.14 29.26,34.09 arc90 29.52,33.83 39.98,33.83 arc-90 40.23,33.58 v40.23,32 | v67.36,13.72 67.36,11.99 arc45 67.44,11.81 68.58,10.67 P1.40
COCO_A0  (via drill 0.33)
  Top 0.152: v29.26,31.62 29.26,31.81 arc-90 29.52,32.06 IC1.81 | v39.32,32 39.32,24.03 arc-90 39.06,23.77 36.58,23.77 36.58,20.68 arc90 36.83,20.42 42.06,20.42 42.06,19.15 arc90 42.32,18.9 v42.98,18.9 | v42.98,11.89 43.21,11.66 arc-45 43.28,11.48 43.28,5.79 43.25,5.76 arc45 43.18,5.58 P1.19
  Bottom 0.152: v39.32,32 36.71,32 arc-45 36.53,32.08 36.47,32.13 35.79,32.13 arc90 35.66,32 29.52,32 arc90 29.26,31.75 v29.26,31.62 | v42.98,18.9 v42.98,11.89
COCO_A1  (via drill 0.33)
  Top 0.152: v43.89,18.59 43.89,18.54 arc-90 43.64,18.29 41.76,18.29 41.76,20.12 36.52,20.12 arc-90 36.27,20.37 36.27,24.08 38.46,24.08 arc90 38.71,24.33 38.71,31.24 arc90 38.56,31.39 v38.41,31.39 | IC1.80 36.04,31.56 arc-45 v36.2,31.5
  Bottom 0.152: v36.2,31.5 v38.41,31.39 | v43.89,18.59 43.89,11.69 arc-45 43.82,11.51 43.28,10.97 43.28,5.41 arc-45 43.21,5.23 P1.20
COCO_A2  (via drill 0.33)
  Top 0.152: IC1.79 35.71,31.06 arc-90 35.97,30.81 35.97,19.81 41.2,19.81 arc-90 41.45,19.56 41.45,17.98 v45.41,17.98 | v45.41,11.89 45.65,11.66 arc-45 45.72,11.48 P1.21
  Bottom 0.152: v45.41,17.98 v45.41,11.89
COCO_A3  (via drill 0.33)
  Top 0.152: IC1.78 35.41,30.56 arc-90 35.66,30.31 35.66,19.51 40.89,19.51 arc-90 41.15,19.25 41.15,17.68 44.09,17.68 arc-45 44.27,17.6 44.5,17.37 45.92,17.37 arc45 46.1,17.45 v46.33,17.68
  Bottom 0.152: v46.33,17.68 46.33,12.3 arc-45 46.26,12.12 45.72,11.28 45.72,6.03 arc45 45.79,5.85 46.02,5.62 arc-45 45.95,5.44 P1.22
COCO_A4  (via drill 0.33)
  Top 0.152: IC1.77 35.1,30.06 arc-90 35.36,29.81 35.36,19.2 40.59,19.2 arc-90 40.84,18.95 40.84,17.37 43.79,17.37 arc-45 43.97,17.3 44.2,17.07 47.6,17.07 arc90 47.85,17.32 v47.85,17.37 | v47.85,11.89 48.19,11.55 arc-45 48.26,11.38 P1.23
  Bottom 0.152: v47.85,17.37 v47.85,11.89
COCO_A5  (via drill 0.33)
  Top 0.152: IC1.76 30.68,29.56 arc-45 30.86,29.49 33.38,26.9 33.71,26.52 33.71,19.15 arc90 33.96,18.9 40.54,18.9 40.54,17.32 arc90 40.79,17.07 43.48,17.07 arc-45 43.66,16.99 43.89,16.76 48.51,16.76 arc90 48.77,17.02 v48.77,17.07
  Bottom 0.152: v48.77,17.07 48.77,11.89 48.33,11.45 arc45 48.26,11.27 P1.24
COCO_A6  (via drill 0.33)
  Top 0.152: IC1.48 12.45,30.56 arc90 12.19,30.31 12.19,21.95 28.7,21.95 arc-90 28.96,21.69 28.96,14.02 39.82,14.02 arc45 40,14.1 40.23,14.33 40.74,14.33 arc-45 40.92,14.25 41.15,14.02 50.19,14.02 arc-45 50.37,13.95 v50.6,13.72 | v50.6,11.89 50.6,5.41 arc90 P1.25
  Bottom 0.152: v50.6,13.72 v50.6,11.89
COCO_A7  (via drill 0.33)
  Top 0.152: IC1.49 12.75,30.06 arc90 12.5,29.81 12.5,22.25 29.01,22.25 arc-90 29.26,22 29.26,14.33 39.52,14.33 arc45 39.7,14.4 39.93,14.63 41.04,14.63 arc-45 41.22,14.56 41.45,14.33 50.8,14.33 arc-45 50.98,14.25 v51.51,13.72
  Bottom 0.152: 51.21,5.46 arc-90 50.95,5.21 P1.26 50.8,8.94 arc-45 50.87,9.12 51.21,9.45 51.21,13.31 arc-45 51.28,13.49 v51.51,13.72
COCO_A8  (via drill 0.33)
  Top 0.152: IC1.63 22.86,26.62 arc-45 22.79,26.44 22.55,26.21 22.55,24.64 arc90 22.81,24.38 31.14,24.38 arc-90 31.39,24.13 31.39,16.46 37.38,16.46 arc45 37.56,16.53 37.8,16.76 43.18,16.76 arc-45 43.36,16.69 43.59,16.46 52.48,16.46 arc90 52.73,16.71 v52.73,16.76 | v52.73,11.89 52.96,11.66 arc-45 53.03,11.48 53.03,9.45 53.27,9.22 arc-45 53.34,9.04 P1.27
  Bottom 0.152: v52.73,16.76 v52.73,11.89
COCO_A9  (via drill 0.33)
  Top 0.152: IC1.61 21.86,24.33 arc90 22.11,24.08 31.09,24.08 31.09,16.41 arc90 31.34,16.15 37.8,16.15 38.03,16.39 arc-45 38.2,16.46 42.87,16.46 arc-45 43.05,16.39 43.28,16.15 53.39,16.15 arc90 53.65,16.41 v53.65,16.46
  Bottom 0.152: v53.65,16.46 53.65,5.46 arc-90 53.39,5.21 P1.28
COCO_A10  (via drill 0.33)
  Top 0.152: IC1.60 21.36,24.03 arc90 21.61,23.77 30.79,23.77 30.79,16.1 arc90 31.04,15.85 38.1,15.85 38.33,16.08 arc-45 38.51,16.15 42.57,16.15 arc-45 42.75,16.08 42.98,15.85 55.22,15.85 arc90 55.47,16.1 v55.47,16.15 | v55.47,11.89 55.47,5.46 arc90 55.73,5.21 P1.29
  Bottom 0.152: v55.47,16.15 v55.47,11.89
COCO_A11  (via drill 0.33)
  Top 0.152: IC1.59 20.86,23.72 arc90 21.11,23.47 30.48,23.47 30.48,15.8 arc90 30.73,15.54 38.41,15.54 38.63,15.78 arc-45 38.81,15.85 42.26,15.85 arc-45 42.44,15.78 42.67,15.54 56.13,15.54 arc90 56.39,15.8 v56.39,15.85
  Bottom 0.152: v56.39,15.85 56.39,5.46 arc-90 56.13,5.21 P1.30
COCO_A12  (via drill 0.33)
  Top 0.152: IC1.58 20.36,23.42 arc90 20.61,23.16 30.18,23.16 30.18,15.24 38.71,15.24 38.94,15.47 arc-45 39.12,15.54 42.06,15.54 42.37,15.24 57.61,15.24 v57.91,15.54 | 57.91,5.82 arc45 57.99,5.64 | 57.99,5.64 P1.31 | v57.91,11.89 57.91,11.08 arc45 57.99,10.9 58.22,10.67 58.22,5.98 arc-45 58.14,5.8 57.99,5.64
  Bottom 0.152: v57.91,15.54 v57.91,11.89
COCO_A13  (via drill 0.33)
  Top 0.152: IC1.57 19.86,23.11 arc90 20.11,22.86 29.62,22.86 arc-90 29.87,22.61 29.87,14.94 38.91,14.94 arc45 39.09,15.01 39.32,15.24 41.65,15.24 arc-45 41.83,15.17 42.06,14.94 64.36,14.94 arc-90 64.62,14.68 64.62,14.58 arc90 64.87,14.33 66.19,14.33 arc-90 66.45,14.07 v66.45,13.72 | 66.14,5.31 arc-90 P1.37 66.07,5.23 arc45 66.14,5.41 66.14,10.67 66.37,10.9 arc45 66.45,11.08 v66.45,11.89
  Bottom 0.152: v66.45,13.72 v66.45,11.89
COCO_A14  (via drill 0.33)
  Top 0.152: IC1.56 19.36,22.81 arc90 19.61,22.55 29.31,22.55 arc-90 29.57,22.3 29.57,14.63 39.32,14.63 39.62,14.94 41.35,14.94 arc-45 41.53,14.86 41.76,14.63 64.06,14.63 arc-90 64.31,14.38 64.31,14.28 arc90 64.57,14.02 65.28,14.02 arc-90 65.53,13.77 v65.53,13.72
  Bottom 0.152: 66.14,5.31 arc-90 P1.38 66.07,5.23 arc45 66.14,5.41 66.14,10.67 65.61,11.2 arc-45 65.53,11.38 v65.53,13.72
COCO_A15  (via drill 0.33)
  Top 0.152: IC1.9 24.86,45.18 arc-45 24.93,45.36 27.43,47.85 40.43,47.85 arc45 40.61,47.93 41.45,48.77 47.75,48.77 arc-45 47.93,48.69 51.51,45.11 51.51,43.54 arc90 51.77,43.28 53.65,43.28 53.65,41.4 arc-90 53.39,41.15 v52.73,41.15 | v46.02,32 46.02,22.81 arc90 46.28,22.55 70.41,22.55 v70.41,13.72 | v70.41,11.89 68.65,10.13 arc45 68.58,9.95 P1.39
  Bottom 0.152: v52.73,41.15 46.02,33.83 v46.02,32 | v70.41,13.72 v70.41,11.89
COCO_D0  (via drill 0.33)
  Top 0.152: IC1.75 28.86,27.08 arc90 29.11,26.82 30.84,26.82 arc90 31.09,27.08 v31.09,27.13
  Bottom 0.152: v31.09,27.13 31.14,27.13 arc-90 31.39,26.87 31.39,11.58 30.55,10.74 arc45 30.48,10.56 P1.10
COCO_D1  (via drill 0.33)
  Top 0.152: IC1.74 28.36,26.77 arc90 28.61,26.52 31.75,26.52 arc90 32,26.77 v32,26.82 | v32.31,11.89 32.95,11.25 arc-45 33.02,11.07 P1.11
  Bottom 0.152: v32.31,11.89 32.31,26.57 arc90 32.05,26.82 v32,26.82
COCO_D2  (via drill 0.33)
  Top 0.152: IC1.73 27.86,26.47 arc90 28.11,26.21 32.66,26.21 arc90 32.92,26.47 v32.92,26.52
  Bottom 0.152: v32.92,26.52 32.92,12.19 33.02,10.97 P1.12
COCO_D3  (via drill 0.33)
  Top 0.152: IC1.70 26.36,26.16 arc90 26.61,25.91 32.92,25.91 32.92,18.54 arc90 33.17,18.29 v33.53,18.29 | P1.13 35.56,10.97 arc45 35.49,11.15 v34.44,11.89
  Bottom 0.152: v33.53,18.29 34.19,18.29 arc-90 34.44,18.03 v34.44,11.89
COCO_D4  (via drill 0.33)
  Top 0.152: IC1.69 25.86,25.86 arc90 26.11,25.6 32.61,25.6 32.61,17.93 arc90 32.87,17.68 36.02,17.68 arc90 36.27,17.93 v36.27,17.98
  Bottom 0.152: v36.27,17.98 36.27,11.89 35.63,11.25 arc45 35.56,11.07 P1.14
COCO_D5  (via drill 0.33)
  Top 0.152: IC1.68 25.36,25.55 arc90 25.61,25.3 32.31,25.3 32.31,17.63 arc90 32.56,17.37 36.58,17.37 36.81,17.6 arc-45 36.99,17.68 37.54,17.68 arc90 37.8,17.93 v37.8,17.98 | v37.8,11.89 38.03,11.66 arc-45 38.1,11.48 P1.15
  Bottom 0.152: v37.8,17.98 v37.8,11.89
COCO_D6  (via drill 0.33)
  Top 0.152: IC1.67 24.86,25.25 arc90 25.11,24.99 32,24.99 32,17.32 arc90 32.26,17.07 36.88,17.07 37.11,17.3 arc-45 37.29,17.37 38.46,17.37 arc90 38.71,17.63 v38.71,17.68
  Bottom 0.152: v38.71,17.68 38.71,11.89 38.17,11.35 arc45 38.1,11.17 P1.16
COCO_D7  (via drill 0.33)
  Top 0.152: IC1.66 24.36,24.94 arc90 24.61,24.69 31.7,24.69 31.7,16.76 37.19,16.76 37.49,17.07 39.67,17.07 arc90 39.93,17.32 v39.93,17.37 | v39.93,11.89 40.57,11.25 arc-45 40.64,11.07 P1.17
  Bottom 0.152: v39.93,17.37 v39.93,11.89
COCO_E  (via drill 0.33)
  Top 0.152: IC1.51 16.87,26.82 v16.15,26.82
  Bottom 0.152: v16.15,26.82 16.15,11.53 arc90 16.41,11.28 25.3,11.28 25.3,5.31 arc90 P1.6
COCO_Q  (via drill 0.33)
  Top 0.152: IC1.50 13.06,29.56 arc90 12.8,29.31 12.8,22.86 v13.41,22.86 | v13.41,21.03 13.41,15.49 arc90 13.66,15.24 28.04,15.24 v28.04,13.72 | v28.04,11.89 28.04,5.31 arc-90 P1.7
  Bottom 0.152: v13.41,22.86 v13.41,21.03 | v28.04,13.72 v28.04,11.89
COCO_R/!W  (via drill 0.33)
  Top 0.152: IC1.46 12.14,31.56 arc90 11.89,31.31 11.89,21.64 28.4,21.64 arc-90 28.65,21.39 28.65,13.72 v40.54,13.72
  Bottom 0.152: 40.54,5.31 arc90 P1.18 arc-90 40.54,5.31 | v40.54,13.72 40.54,5.31
COCO_SND  (via drill 0.33)
  Top 0.152: IC1.6 26.36,44.85 arc-45 26.43,45.03 28.35,46.94 36.88,46.94 arc-90 37.13,46.69 v37.13,43.89 | v42.06,31.39 42.06,21.34 v58.83,16.76 | v62.79,11.89 63.43,11.25 arc-45 63.5,11.07 P1.35 | v60.05,16.76 62.53,16.76 arc-90 62.79,16.51 v62.79,15.85
  Bottom 0.152: v37.13,43.89 42.06,34.14 v42.06,31.39 | v58.83,16.76 v60.05,16.76 | v62.79,15.85 v62.79,11.89
ENET_CRS  (via drill 0.33)
  Top 0.152: IC1.92 arc45 30.78,37.49 v35.97,37.49 | v37.8,37.49 40.13,37.49 arc-45 40.31,37.42 41.45,36.27 50.04,36.27 arc-90 50.29,36.02 v50.29,33.22 | v53.95,33.22 54.1,33.07 arc45 54.28,33 IC3.40
  Bottom 0.152: v35.97,37.49 v37.8,37.49 | v50.29,33.22 v53.95,33.22
ENET_MDC  (via drill 0.33)
  Top 0.152: IC1.87 v35.97,35.05 | v37.8,35.05 47.6,35.05 arc-90 47.85,34.8 v47.85,34.75 | v61.87,34.44 61.91,34.47 arc45 61.98,34.65 IC3.31
  Bottom 0.152: v35.97,35.05 v37.8,35.05 | v47.85,34.75 61.62,34.75 arc-90 61.87,34.49 v61.87,34.44
ENET_MDIO  (via drill 0.33)
  Top 0.152: IC1.86 35.24,34.56 arc-90 v35.36,34.44 | v38.41,34.44 46.99,34.44 arc-90 47.24,34.19 v47.24,33.83 | v62.79,34.44 62.55,34.68 arc-45 62.48,34.86 IC3.30
  Bottom 0.152: v35.36,34.44 v38.41,34.44 | v47.24,33.83 62.53,33.83 arc90 62.79,34.09 v62.79,34.44
ENET_OSC_EN
  Top 0.152: OSC2.1 49.99,40.54 50.29,41.45 50.29,42.37 arc90 44.5,48.16 44.2,48.16 arc90 38.71,42.67 29.9,42.65 28.96,41.76 28.96,40.84 26.21,38.1 28.65,35.66 28.65,33.78 arc-90 28.4,33.53 16.76,33.53 16.37,33.13 arc-45 16.19,33.06 IC1.43
ENET_REF_CLK
  Top 0.152: IC1.88 29.47,35.56 arc-45 29.29,35.63 26.82,38.1 29.26,40.54 29.26,41.37 arc-45 29.34,41.55 30,42.19 38.76,42.22 arc45 38.94,42.29 39.01,42.37 arc-90 44.5,47.85 arc-90 49.99,42.37 49.99,42.06 49.68,40.84 48.77,39.32 58.99,39.32 arc-90 59.24,39.06 OSC2.3
  Top 0.254: IC3.34 60.48,37.2 arc90 60.23,37.46 59.26,37.46 59.26,38.3 arc90 OSC2.3
ENET_RST  (via drill 0.33)
  Top 0.152: v37.8,32.61 47.3,32.61 arc-90 47.55,32.36 47.55,30.18 v49.68,30.18 | IC3.29 62.98,35.27 arc45 63.05,35.09 v63.7,34.44
  Top 0.254: IC1.44 arc-45 15.24,32.61 v28.04,32.61
  Bottom 0.152: v28.04,32.61 v37.8,32.61 | v49.68,30.18 58.88,30.18 arc90 59.13,30.43 59.13,33.53 63.45,33.53 arc90 63.7,33.78 v63.7,34.44
ENET_RX_ER  (via drill 0.33)
  Top 0.152: IC1.89 34.55,36.06 arc-45 34.73,35.99 35.05,35.66 v35.36,35.66 | v38.41,35.66 40.13,35.66 arc-45 40.31,35.59 40.54,35.36 48.21,35.36 arc-90 48.46,35.1 v48.46,32.31 | v52.73,32.31 52.85,32.43 arc-45 53.03,32.5 IC3.41
  Bottom 0.152: v35.36,35.66 v38.41,35.66 | v48.46,32.31 v52.73,32.31
ENET_RXD0  (via drill 0.33)
  Top 0.152: IC1.91 35.18,37.06 arc-90 v35.36,36.88 | v38.41,36.88 40.13,36.88 arc-45 40.31,36.81 41.15,35.97 49.43,35.97 arc-90 49.68,35.71 v49.68,31.39 | v52.12,31.39 52.15,31.43 arc-45 52.33,31.5 IC3.43
  Bottom 0.152: v35.36,36.88 v38.41,36.88 | v49.68,31.39 v52.12,31.39
ENET_RXD1  (via drill 0.33)
  Top 0.152: IC1.90 34.66,36.56 arc-45 34.84,36.49 35.05,36.27 v35.97,36.27 | v37.8,36.27 40.13,36.27 arc-45 40.31,36.2 40.84,35.66 48.82,35.66 arc-90 49.07,35.41 49.07,30.79 v50.29,30.79 | v52.73,30.79 52.87,30.93 arc-45 53.05,31 IC3.44
  Bottom 0.152: v35.97,36.27 v37.8,36.27 | v50.29,30.79 v52.73,30.79
ENET_TX_EN  (via drill 0.33)
  Top 0.152: IC1.93 27.78,38.06 arc-90 v27.74,38.1 | v38.41,38.1 40.13,38.1 arc-45 40.31,38.03 41.76,36.58 50.65,36.58 arc-90 50.9,36.32 50.9,23.77 v59.74,23.77 | v59.74,25.6 59.91,25.77 arc45 59.98,25.95 IC3.2
  Bottom 0.152: v27.74,38.1 v38.41,38.1 | v59.74,25.6 v59.74,23.77
ENET_TXD0  (via drill 0.33)
  Top 0.152: IC1.95 29.21,39.06 arc-90 v28.96,39.31 v28.96,39.32 | v34.14,39.32 40.13,39.32 arc-45 40.31,39.24 42.37,37.19 51.26,37.19 arc-90 51.51,36.93 51.51,24.99 55.78,24.99 56.39,24.99 60.23,24.99 arc90 60.48,25.25 IC3.3
  Bottom 0.152: v28.96,39.32 v34.14,39.32
ENET_TXD1  (via drill 0.33)
  Top 0.152: IC1.94 28.5,38.56 arc-90 v28.35,38.71 | v37.8,38.71 40.13,38.71 arc-45 40.31,38.63 42.06,36.88 50.95,36.88 arc-90 51.21,36.63 51.21,24.38 56.39,24.38 56.69,24.38 60.73,24.38 arc90 60.98,24.64 IC3.4
  Bottom 0.152: v28.35,38.71 v37.8,38.71
FTDI_RXD  (via drill 0.33)
  Top 0.152: v38.71,49.68 v62.48,49.68 | IC1.98 31.62,40.56 arc45 31.8,40.63 32.31,41.15 34.34,41.15 arc-45 34.52,41.07 v35.05,40.54
  Bottom 0.152: v62.48,49.68 64.52,49.68 arc90 64.77,49.94 JP1.5 | v35.05,40.54 36.27,40.54 36.27,43.59 v38.71,49.68
FTDI_TXD  (via drill 0.33)
  Top 0.152: IC1.99 31.51,41.06 arc45 31.69,41.13 32,41.45 v35.05,41.45 | v38.41,50.9 61.92,50.9 arc90 62.18,51.16 v62.18,57.61
  Bottom 0.152: v35.05,41.45 v38.41,50.9 | v62.18,57.61 arc90 62.23,57.66 JP1.4
GND  (via drill 0.33, 0.6)
  Top 0.152: 57.61,36.71 v57.61,36.88 arc-90 57.59,36.89 | 59.48,36.63 IC3.36 | IC3.35 59.98,36.63 | 62.18,31.7 arc-90 IC3.49 | 61.38,39.93 arc-90 C17.2 | C18.2 59.24,45.16 arc-90 59.49,45.41 v59.74,45.41 61.36,45.41 arc-90 61.61,45.16 C16.C | 62.31,30 arc90 v62.18,29.87 | 72.54,36.18 arc-90 C14.2 | v45.92,58.47 arc-90 45.72,58.67 45.72,62.18 48.77,62.18 | 48.77,62.18 arc-90 49.02,61.92 JP2.5 | JP2.3 50.29,61.92 arc90 50.04,62.18 48.77,62.18 | SD.GND 11.89,57.89 v11.89,59.44
  Top 0.254: IC1.97 32.81,40.06 arc90 C2.2 v34.14,40.23 | IC1.31 12.02,39.06 arc90 C5.2 arc45 11.77,38.96 v10.67,38.96 | v57.61,36.88 59.23,36.88 | 59.23,36.88 arc-90 59.48,36.63 | 59.98,36.63 arc90 59.73,36.88 59.23,36.88 | IC3.15 62.31,30 | IC3.19 65.18,32 arc-90 64.92,32.25 v64.92,32.31 | v18.9,29.57 arc45 18.86,29.48 IC1.55 | C20.2 54.94,29.43 arc-45 55.12,29.5 IC3.47 | IC1.83 29.53,33.06 arc-45 29.35,33.13 v29.26,33.22 | v6.71,43.28 6.71,41.95 arc45 C10.1 | IC1.41 15.97,34.06 arc45 16.15,34.13 v16.46,34.44 | IC1.15 v21.87,41.76 | IC1.11 v23.85,41.76 | JP3.1 v38.71,60.96 JP4.1 | SD.GND1 arc-90 1.67,61.57 | v13.41,60.66 arc90 13.53,60.54 | C8.1 arc90 18.32,53.95 | OSC1.2 arc-90 16.68,49.99 | IC1.72 v27.33,29.49
  Top 0.508: 57.61,36.71 arc-90 57.35,36.46 C19.2 | 57.59,36.89 OSC2.2 | v62.18,29.87 62.18,31.7 | v62.48,39.93 61.38,39.93 | v69.49,38.71 68.56,38.71 arc90 68.3,38.46 R8.1 | v69.49,38.71 70.36,38.71 arc-90 70.62,38.46 C13.2 | v69.49,38.71 69.49,39.85 arc90 69.24,40.1 C12.C | v72.54,35.05 72.54,36.18 | v80.77,35.36 79.45,35.36 arc-90 C15.2 | v84.12,41.76 84.12,40.62 arc90 C21.2 | v78.64,42.98 78.64,41.92 arc-90 C22.2 | v14.38,42.62 C11.1 | v53.34,28.96 54.47,28.96 arc90 C20.2 | 1.67,61.57 v3.66,61.57 | 13.53,60.54 SD.GND3 | 18.32,53.95 v19.2,53.95 | 16.68,49.99 v15.54,49.99 | C6.C 30,49.43 arc-90 30.25,49.68 v31.7,49.68 | v34.14,29.26 34.14,27.96 arc90 C7.C
  Top 1.27: P1.33 v60.96,12.7
  Bottom 1.27: P1.33 v60.96,12.7
  pour Bottom: 0,63.5 88.9,63.5 88.9,11.43 0,11.43
ISP  (via drill 0.33)
  Top 0.152: IC1.53 17.86,28.7 arc90 17.61,28.96 17.02,28.96 arc-90 16.76,29.21 v16.76,31.7 | v17.37,34.14 21.03,34.14 21.03,40.18 arc-90 21.29,40.44 27.13,40.44 30.1,43.31 34.38,43.31 arc-45 34.44,43.28 v35.36,46.02 | v36.27,48.77 37.49,52.12 41.5,52.12 arc90 41.76,52.38 v41.76,52.73 | v41.76,57.91 43.04,57.91 arc90 R3.1
  Top 0.254: R3.1 JP4.2
  Bottom 0.152: v16.76,31.7 v17.37,34.14 | v35.36,46.02 v36.27,48.77 | v41.76,52.73 v41.76,57.91
LED_LINK  (via drill 0.33)
  Top 0.152: IC3.28 63.48,37.84 arc-90 63.73,38.1 64.05,38.1 64.05,48.01 arc-90 64.3,48.26 v64.77,48.26 | v67.31,48.26 71.35,48.26 arc90 71.61,48.51 71.61,50.76 74.68,50.76 arc90 74.93,51.02 74.93,58.42 73.79,58.42 arc90 ETH_MAGJACK.L2
  Bottom 0.152: v64.77,48.26 v67.31,48.26
LED_SPEED  (via drill 0.33)
  Top 0.152: IC3.27 63.98,37.42 arc-90 64.23,37.68 64.75,37.68 64.75,46.97 arc-90 v64.77,46.99 | v67.31,46.99 71.92,46.99 arc90 72.17,47.24 72.17,50.13 79.76,50.13 arc90 80.01,50.38 80.01,54.61 83.78,56.43 ETH_MAGJACK.L4
  Bottom 0.152: v64.77,46.99 v67.31,46.99
N$3
  Top 0.254: IC1.10 24.36,46.15 arc90 24.11,46.41 L1.1 23.61,46.41 arc90 23.36,46.15 IC1.12
  Top 0.508: 24.36,46.15 24.36,48.21 arc-90 24.61,48.46 26.95,48.46 arc90 27.2,48.72 C6.A
N$4
  Top 0.254: IC1.22 18.36,46.02 arc90 C9.1
N$5
  Top 0.254: C9.2 18.29,49.94 arc-90 OSC1.3
N$6
  Top 0.254: IC3.24 68.05,34.5 arc90 68.3,34.75 R8.2
N$8
  Top 0.254: Q1.3 arc90 Q1.3 R5.1
N$11
  Top 0.152: IC3.39 55.3,33.5 arc-45 55.12,33.57 54.86,33.83 52.92,33.83 arc45 52.74,33.76 R11.1
N$12
  Top 0.254: IC3.21 74.64,33 arc90 74.89,33.25 R9.1
N$13
  Top 0.254: IC3.20 77.02,32.5 arc90 77.27,32.75 R10.1
N$14
  Top 0.152: R16.1 71.08,56.73 arc90 ETH_MAGJACK.L1
N$15
  Top 0.152: R17.1 68.8,54.3 arc90 69.05,54.55 69.05,55.32 72.45,55.78 72.45,59.44 arc-90 72.7,59.69 81.28,59.69 ETH_MAGJACK.L3
PFBOUT
  Top 0.152: IC3.37 61.01,34.5 arc-90 61.27,34.25 61.27,33.83 64.31,33.83 | 64.31,33.83 64.92,33.83 65.02,33.93 arc-45 65.19,34 IC3.23 | IC3.18 64.57,31.5 arc-90 64.31,31.75 64.31,33.83
  Top 0.254: IC3.37 54.77,34.5 arc-90 C19.1 | IC3.23 70.36,34 arc90 70.62,34.25 C13.1 71.43,36.23 arc90 71.68,36.49 C12.A | C15.1 79.34,31.75 arc-90 79.09,31.5 IC3.18
RD_N
  Top 0.254: IC3.13 86.35,29 arc90 86.61,29.25 86.61,35.56 | 86.61,35.56 86.61,48.26 arc90 86.35,48.51 73.28,48.51 arc90 73.03,48.26 ETH_MAGJACK.R8 | R13.1 86.61,35.57 arc90 86.61,35.56
RD_P
  Top 0.254: IC3.14 85.84,29.5 arc90 86.1,29.75 86.1,39.37 | 86.1,39.37 86.1,41.39 arc90 85.78,41.71 85.37,41.71 arc-90 85.06,42.02 85.06,42.1 arc-90 85.37,42.42 85.78,42.42 arc90 86.1,42.73 86.1,42.81 arc90 85.78,43.13 85.37,43.13 arc-90 85.06,43.44 85.06,43.52 arc-90 85.37,43.84 85.78,43.84 arc90 86.1,44.15 86.1,44.23 arc90 85.78,44.54 85.37,44.54 arc-90 85.06,44.86 85.06,44.94 arc-90 85.37,45.25 85.78,45.25 arc90 86.1,45.57 86.1,45.65 arc90 85.78,45.96 85.37,45.96 arc-90 85.06,46.28 85.06,46.35 arc-90 85.37,46.67 85.78,46.67 arc90 86.1,46.99 86.1,47.75 arc90 85.84,48.01 74.55,48.01 arc90 74.3,47.75 ETH_MAGJACK.R7 | R12.2 86.1,39.37
SD_CS  (via drill 0.33)
  Top 0.152: SD.CS 7.4,56.11 arc-90 7.15,55.85 2.06,55.85 v2.06,53.34 arc90 v2.06,53.34 | v2.05,50.8 2.05,46.29 arc-90 2.04,46.27 2.04,37.38 arc90 2.29,37.13 v7.62,37.13 | IC1.35 10.21,37.06 arc-90 v10.18,37.09
  Bottom 0.152: v2.06,53.34 2.06,50.81 arc-90 v2.05,50.8 | v10.18,37.09 7.67,37.09 arc-90 v7.62,37.13
SD_DI  (via drill 0.33)
  Top 0.152: SD.DI 8.5,55.47 arc-90 8.25,55.22 3.19,55.22 v3.19,53.33 | v3.18,50.8 3.18,38.09 arc-90 v3.17,38.08 | v3.14,35.56 arc-90 v3.14,35.56 v7.62,35.56 | IC1.38 v10.16,35.56
  Bottom 0.152: v3.19,53.33 3.19,50.81 arc-90 v3.18,50.8 | v3.17,38.08 3.17,35.59 arc-90 v3.14,35.56 | v10.16,35.56 v7.62,35.56
SD_DO  (via drill 0.33)
  Top 0.152: SD.DO 12.9,56.47 arc-90 12.65,56.21 9.45,56.21 9.45,54.23 arc-90 9.19,53.98 5.74,53.98 v5.74,53.35 | v5.72,50.78 v5.72,38.83 | v11.24,36.3 11.41,36.13 arc45 11.59,36.06 IC1.37
  Bottom 0.152: v5.74,53.35 5.74,50.8 arc-90 v5.72,50.78 | v5.72,38.83 5.72,36.56 arc90 5.98,36.3 v11.24,36.3
SD_SCK  (via drill 0.33)
  Top 0.152: SD.SCLK 10.7,56.85 arc-90 10.45,56.6 8.95,56.6 8.95,54.84 arc-90 8.7,54.59 4.4,54.59 4.4,53.33 arc-90 v4.39,53.31 | v4.36,50.8 4.36,38.35 arc90 4.62,38.1 v7.62,38.1 | v10.16,38.1 11.43,38.1 11.9,37.63 arc45 12.07,37.56 IC1.34
  Bottom 0.152: v4.39,53.31 4.39,50.82 arc-90 v4.36,50.8 | v7.62,38.1 v10.16,38.1
TCK/SWDCLK  (via drill 0.33)
  Top 0.152: IC1.5 26.86,44.43 arc-45 26.93,44.61 28.65,46.33 v31.39,46.33 | v31.39,48.46 35.05,50.6 35.05,54 arc-90 35.31,54.25 50.29,54.25 JP2.4
  Bottom 0.152: v31.39,46.33 v31.39,48.46
TD_N
  Top 0.254: IC3.16 82.55,30.5 arc90 82.8,30.75 82.8,36.99 | 82.8,36.99 82.8,40.7 arc90 82.55,40.96 80.9,40.96 arc-90 80.64,41.21 80.64,42.88 arc-90 80.96,43.2 82.41,43.2 arc90 82.73,43.51 82.73,43.81 arc90 82.41,44.13 80.96,44.13 arc-90 ETH_MAGJACK.R2 | R15.1 83.06,37.25 arc90 82.8,36.99
TD_P
  Top 0.254: IC3.17 82.04,31 arc90 82.3,31.25 82.3,39.37 | 82.3,39.37 82.3,40.2 79.7,40.2 arc-90 79.44,40.45 | ETH_MAGJACK.R1 79.44,45.2 79.44,40.45 | 79.44,40.45 79.44,40.41 | R14.2 82.06,39.13 arc90 82.3,39.37
TDI  (via drill 0.33)
  Top 0.152: v33.6,48.46 35.66,49.99 35.66,53.39 arc-90 35.92,53.65 52.05,53.65 arc90 52.3,53.9 52.3,58.14 48.01,58.14 arc90 47.75,57.89 JP2.8 | IC1.2 28.36,44.1 arc-45 28.43,44.28 29.26,45.11 v33.53,45.11
  Bottom 0.152: v33.53,45.11 v33.6,48.46
TDO/SWO  (via drill 0.33)
  Top 0.152: IC1.1 28.86,43.94 arc-90 29.11,44.2 v31.7,44.2 | v34.75,48.46 35.97,49.68 35.97,53.09 arc-90 36.22,53.34 52.48,53.34 arc90 52.73,53.59 52.73,58.52 47.37,58.52 arc90 47.12,58.27 47.12,54.59 48.77,54.59 arc90 49.02,54.84 JP2.6
  Bottom 0.152: v31.7,44.2 34.44,44.2 v34.75,48.46
TMS/SWDIO  (via drill 0.33)
  Top 0.152: IC1.3 27.86,44.21 arc-45 27.93,44.39 29.26,45.72 v32.46,45.72 | v32.49,48.44 35.36,50.29 35.36,53.7 arc-90 35.61,53.95 51.51,53.95 51.51,56.34 arc-90 JP2.2
  Bottom 0.152: v32.46,45.72 v32.49,48.44
USB2_N  (via drill 0.33)
  Top 0.254: R7.1 9.99,45.1 arc90 10.24,45.35 10.24,55.44 arc-90 10.49,55.69 19.07,55.69 v18.98,55.91 18.98,55.69 18.81,55.69
  Bottom 0.254: USB.2 25.87,53.48 arc-90 25.62,53.22 20.78,53.22 arc-90 20.52,53.48 20.52,55.44 arc90 20.27,55.69 18.98,55.69 v18.98,55.91
USB2_P  (via drill 0.33)
  Top 0.254: R6.1 10.9,45.12 arc-90 10.65,45.37 10.65,49.53 arc-90 10.96,49.85 11.09,49.85 arc90 11.4,50.16 11.4,50.49 arc90 11.09,50.81 10.96,50.81 arc-90 10.65,51.12 10.65,55.03 arc-90 10.9,55.28 19.07,55.28 v18.98,55.07 18.98,55.28 18.81,55.28
  Bottom 0.254: USB.3 26.67,53.07 arc-90 26.42,52.81 20.37,52.81 arc-90 20.12,53.07 20.12,55.03 arc90 19.86,55.28 18.98,55.28 v18.98,55.07
USB_CONNECT  (via drill 0.33)
  Top 0.152: Q1.1 3.31,25.96 arc-90 3.57,26.21 6.45,26.21 arc-90 6.71,25.96 6.71,25.6 v10.06,25.6 | v23.36,25.86 IC1.64 | v13.41,25.6 v18.62,25.6
  Bottom 0.152: v10.06,25.6 v13.41,25.6 | v18.62,25.6 23.11,25.6 arc90 v23.36,25.86
USB_N
  Top 0.254: IC1.30 13.91,39.56 arc-45 13.8,39.61 9.84,39.61 arc-90 9.58,39.86 9.58,40.84 9.58,41.12 9.58,41.45 9.58,41.91 | R7.2 9.94,43.3 arc-90 10.19,43.05 10.19,42.43 arc-90 10.01,42.25 9.84,42.25 arc90 9.58,42 9.58,41.91 | C10.2 9.58,41.91
USB_P  (via drill 0.33)
  Top 0.254: IC1.29 13.91,40.06 arc45 13.8,40.02 10.24,40.02 arc-90 9.99,40.27 9.99,40.84 9.99,41.12 9.99,41.82 arc-90 10.01,41.84 10.34,41.84 arc90 10.6,42.1 | R6.2 10.76,43.32 arc90 10.6,43.16 10.6,42.1 | 10.6,42.1 C11.2 arc45 11.65,41.92 v12.5,41.92 | R5.2 8.24,29.1 arc45 8.42,29.18 9.82,30.57 v9.82,32.45
  Bottom 0.254: v9.82,32.45 9.82,32.52 arc-45 9.89,32.7 12.7,35.51 12.7,41.61 arc45 12.63,41.79 v12.5,41.92

### Text on the board
tPlace: Copyright 2016 Adam Green / CC-BY-SA